# Altium schematic sheet Motor.SchDoc
size Legal; SheetNumber: 6; SheetTotal: 12
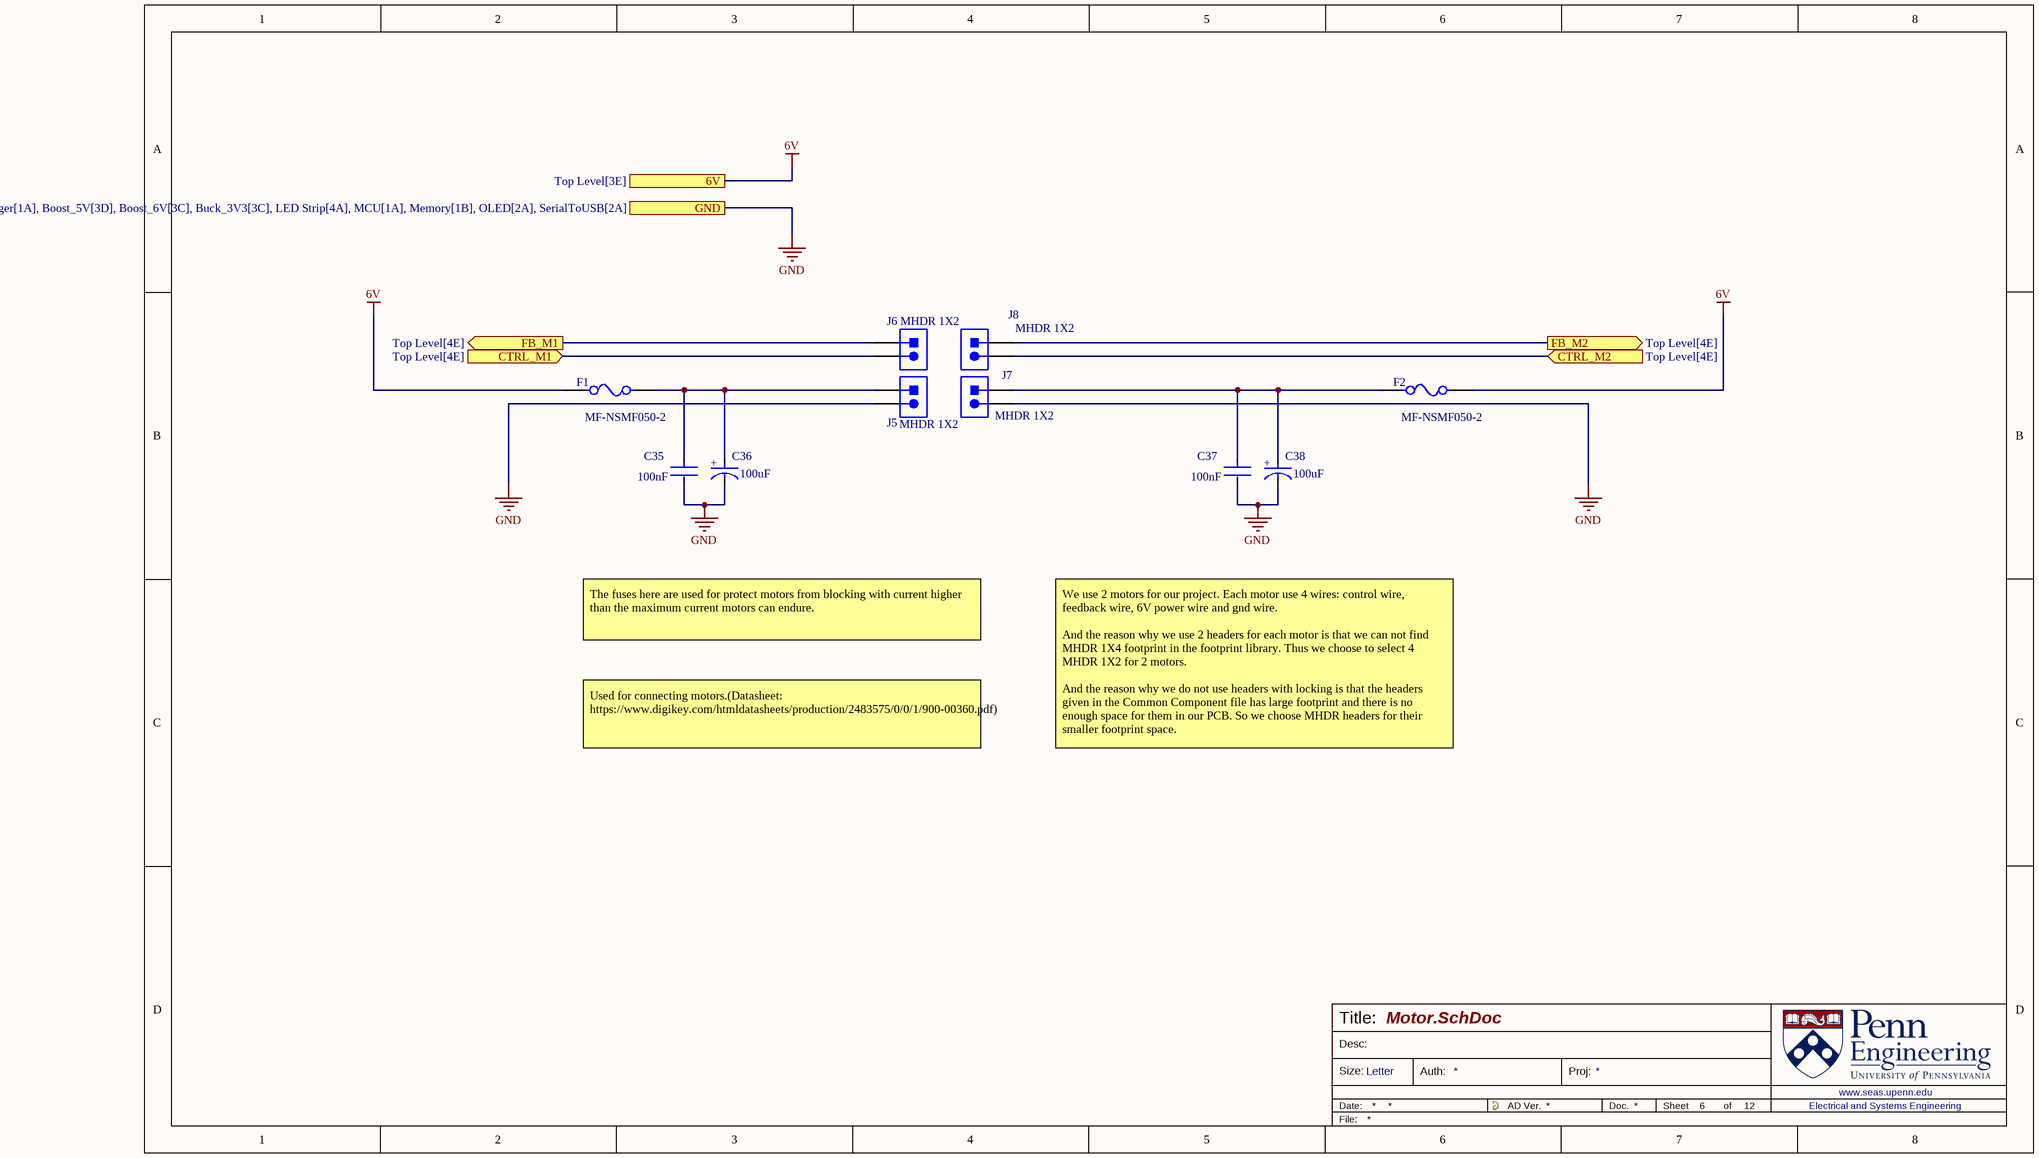
[diagram p0: Motor.SchDoc]

## Parts
C35  100nF  [FP-CC0603-DA-MFG]
C36  100uF  [FP-RAD-TH-D_8_0_5-L_11_5-MFG]
C37  100nF  [FP-CC0603-DA-MFG]
C38  100uF  [FP-RAD-TH-D_8_0_5-L_11_5-MFG]
F1  MF-NSMF050-2  [FP-MF-NSMF050-2-MFG]
F2  MF-NSMF050-2  [FP-MF-NSMF050-2-MFG]
J5  MHDR 1X2  [PH1-02-UA]
J6  MHDR 1X2  [PH1-02-UA]
J7  MHDR 1X2  [PH1-02-UA]
J8  MHDR 1X2  [PH1-02-UA]

## Ports
6V (see Top Level[3E]), CTRL_M1 (in, see Top Level[4E]), CTRL_M2 (in, see Top Level[4E]), FB_M1 (out, see Top Level[4E]), FB_M2 (out, see Top Level[4E]), GND (see Top Level[3E], AI_Audio_Module[4A], BatteryCharger[1A], Boost_5V[3D], Boost_6V[3C], Buck_3V3[3C], LED Strip[4A], MCU[1A], Memory[1B], OLED[2A], SerialToUSB[2A])

## Nets
6V: F1.1 F2.2 ; port 6V
GND: C35.2 C36.1(C) C37.2 C38.1(C) J5.2 J7.2 ; port GND
CTRL_M1: J6.2 ; port CTRL_M1
CTRL_M2: J8.2 ; port CTRL_M2
FB_M1: J6.1 ; port FB_M1
FB_M2: J8.1 ; port FB_M2
NetC35_1: C35.1 C36.2(A) F1.2 J5.1
NetC37_1: C37.1 C38.2(A) F2.1 J7.1

## Notes on the sheet
- The fuses here are used for protect motors from blocking with current higher than the maximum current motors can endure.
- Used for connecting motors.(Datasheet: https://www.digikey.com/htmldatasheets/production/2483575/0/0/1/900-00360.pdf)
- We use 2 motors for our project. Each motor use 4 wires: control wire, feedback wire, 6V power wire and gnd wire.
  And the reason why we use 2 headers for each motor is that we can not find MHDR 1X4 footprint in the footprint library. Thus we choose to select 4 MHDR 1X2 for 2 motors.
  And the reason why we do not use headers with locking is that the headers given in the Common Component file has large footprint and there is no enough space for them in our PCB. So we choose MHDR headers for their smaller footprint space.
- Title:
- Desc:
- Size:
- Letter
- Auth:
- Proj:
- Sheet
- of
- www.seas.upenn.edu
- Electrical and Systems Engineering
- (in symbol CMP-05427-002079-1) +

## Library data of the parts
C35 C37 = CMP-2000-05002-2: CAP CER 0.1UF 16V X7R 0603; Manufacturer Part Number: CC0603KRX7R7BB104; Manufacturer: YAGEO; Tolerance: 0.1; Temperature Coefficient: 15%; Material: Ceramic; Voltage Rating: 16 V; Package: CC0603-DA; ComponentLink2Description: Datasheet; Octopart: https://octopart.com/cc0603krx7r7bb104-yageo-192941; Temperature Range High: +125°C; Digikey Description: CAP CER 0.1UF 16V X7R 0603; Value: 100 nF; Voltage: 16 V; Device Class L2: Capacitors; Height: 0.9mm; Temperature: -55°C to +125°C; Device Class L1: Passive Components; Device Class L3: Ceramic Capacitors; ComponentLink2URL: http://www.yageo.com/documents/recent/UPY-GPHC_X7R_6.3V-to-50V_18.pdf; Footprint Url: http://www.yageo.com/exep/pages/download/literatures/UPY-C_GEN_24.pdf; RoHS: TRUE; Temperature Range Low: -55°C; Temperature Characteristic: X7R; Lead Free: Yes; Capacitance: 100 nF; Category: Cap; Mouser Description: Multilayer Ceramic Capacitor, CC Series, 0.1 - F, - 10%, X7R, 16 V, 0603 [1608 Metric]; Automotive: No
C36 C38 = CMP-05427-002079-1: Aluminum Electrolytic Capacitors (Radial Lead Type) 100uF ±20% 50V; ESR (Equivalent Series Resistance): 61mR; Lead Diameter: 0.6mm; Ripple Current (AC): 870mA; Life (Hours): 6000Hour; Lead/Base Style: Straight; Height - Seated (Max): 0.512inch; Height: 11.5mm; REACH SVHC: No SVHC; Contact Plating: Tin; Impedance: 61mR; Capacitance: 100uF; Voltage: 50V; Termination: Radial; Series: FR; Voltage Rating: 50V; Lead Pitch: 3.5mm; Diameter: 8mm; Number of Pins: 2; Min Operating Temperature: -40°C; Mount: Through Hole; Ripple Current: 870mA; Radiation Hardening: No; Length: 11.5mm; Max Operating Temperature: 105°C; Construction: RADIAL; Packaging: Bulk; Package Quantity: 200; Case/Package: Radial; RoHS Compliant: Yes; Voltage Rating (DC): 50V; Tolerance: 20%
F1 F2 = CMP-07400-000036-1: PTC RESET FUSE 13.2V 500MA 1206; Manufacturer: Bourns; Resistance: 0.15-0.7Ω; Hold Current: 0.5A; Trip Current: 1A; Current Rating: 100A; Value: 0.15-0.7Ω; Automotive Grade: Grade 3; Trip Time: 0.1s; Temperature Range Low: -40°C; Temperature: -40°C to +85°C; Digikey Description: PTC RESET FUSE 13.2V 500MA 1206; Ambient Temperature Range Low: -40°C; RoHS: TRUE; Device Class L2: PTC Resettable Fuses; Octopart: https://octopart.com/mf-nsmf050-2-bourns-34532; ComponentLink2Description: Datasheet; Voltage Rating: 13.2V; Category: Fuse; ComponentLink2URL: https://www.bourns.com/docs/product-datasheets/mfnsmf.pdf?sfvrsn=39c76af6_14; Mouser Description: Resettable Fuses - PPTC 0.50A 13.2V 0.15ohm 1206 Footprint; Temperature Range High: +85°C; Device Class L1: Circuit Protection; Device Class L3: unset; Automotive: Yes; Package: MF-NSMF050-2; Ambient Temperature Range High: +85°C; Height: 0.85mm; Manufacturer Part Number: MF-NSMF050-2; Lead Free: Yes
J5-J8 = CMP-000021-1: Header, 2-Pin, 0.1in Pitch, Male